# EAGLE schematic Steuerung (EAGLE 9.6.2)
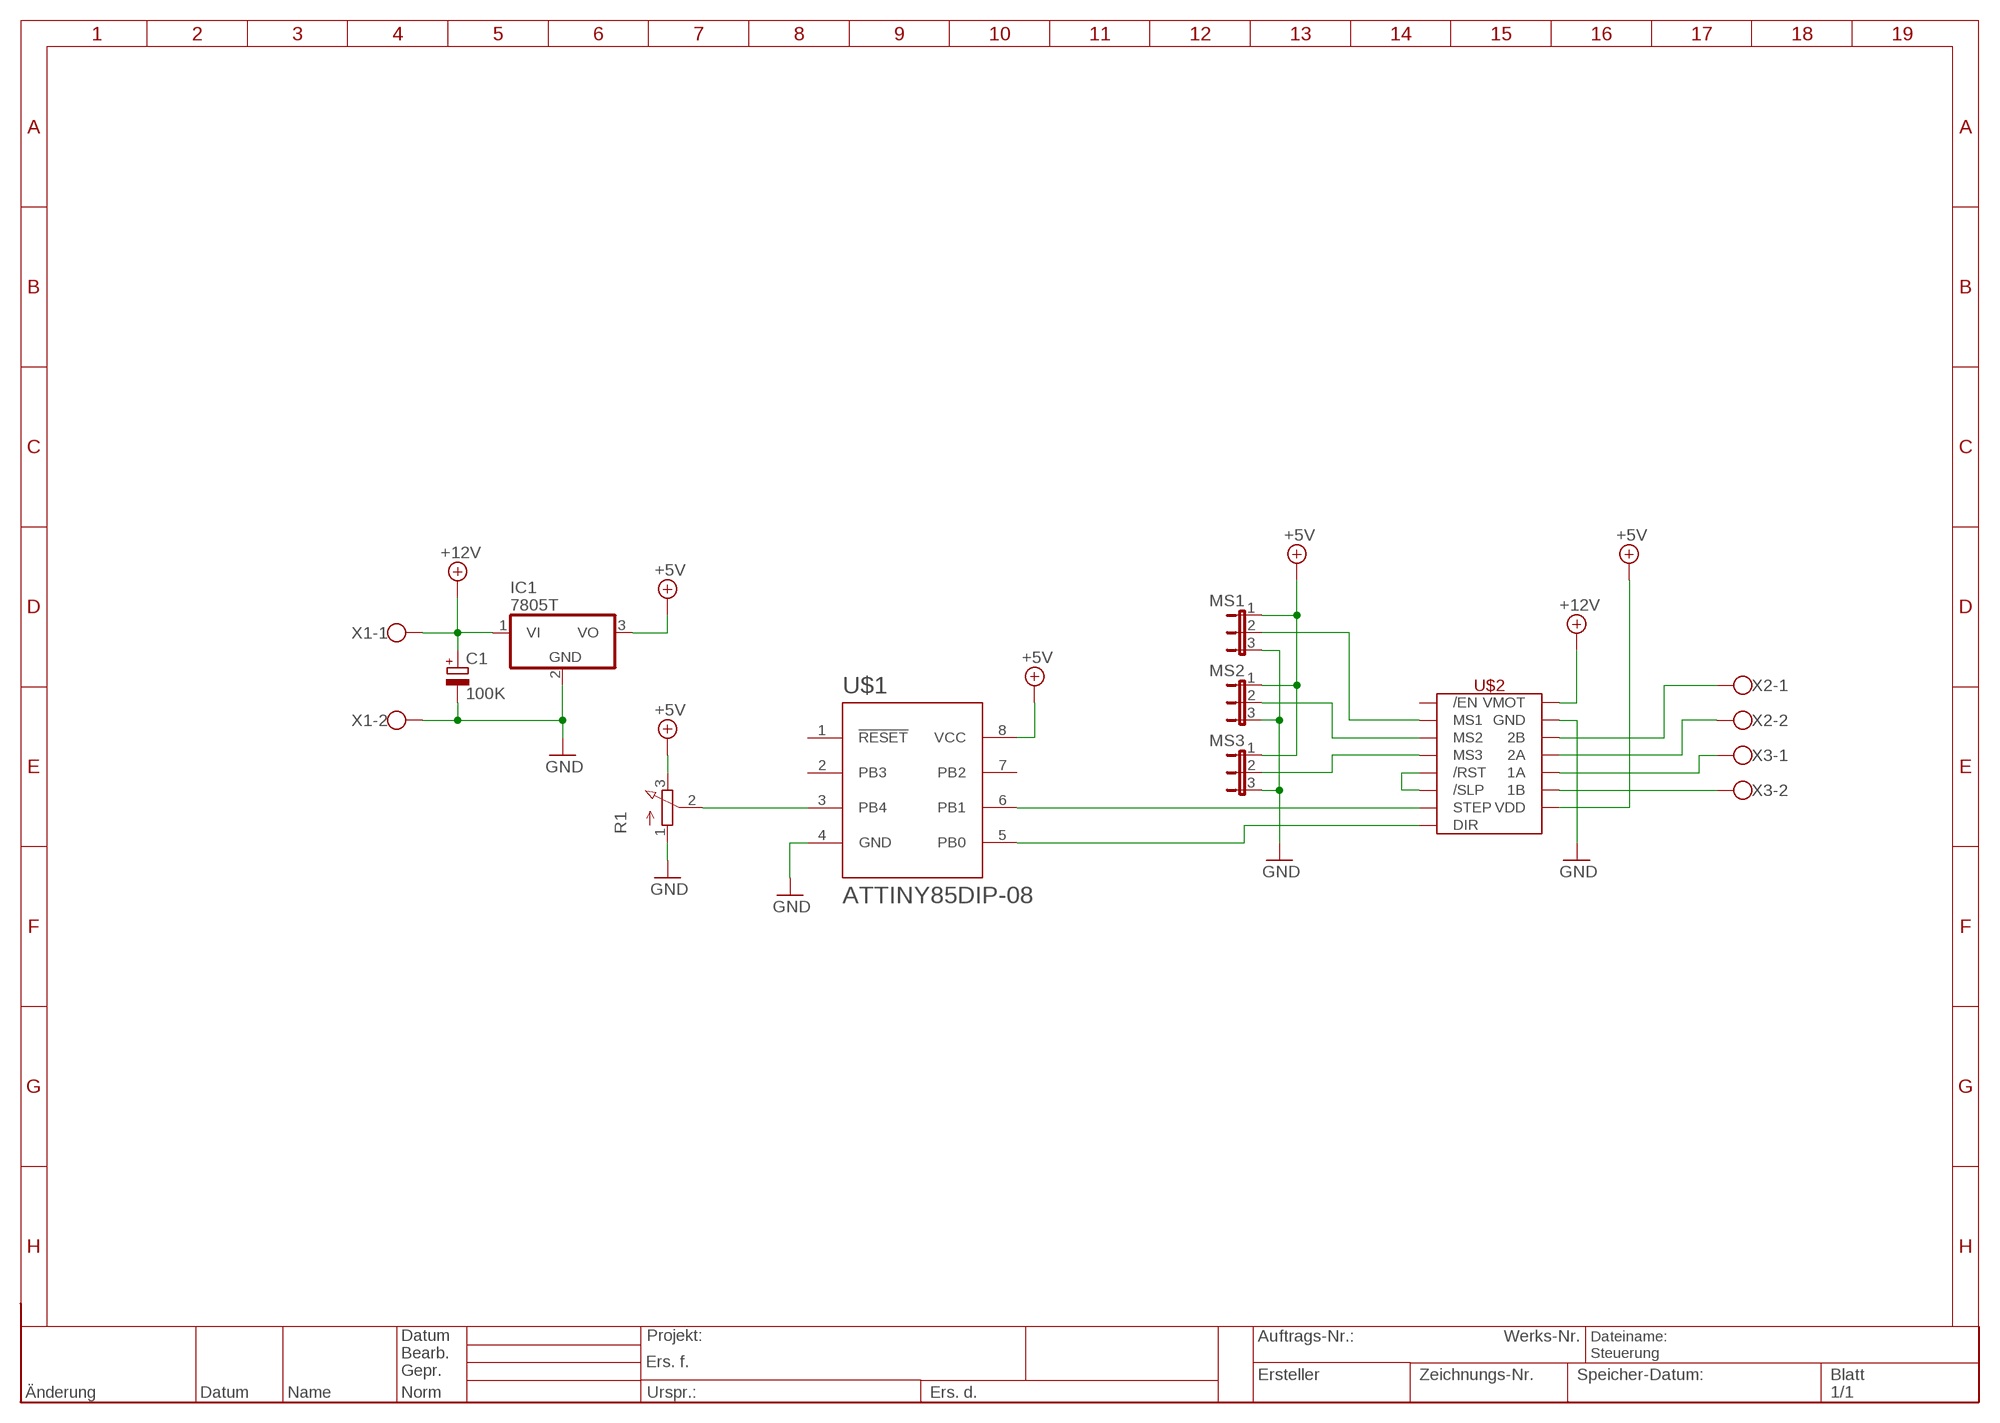
[diagram p0: schematic, sheet 1]

## Parts
C1  100K  CPOL-EUE2-5  [E2-5]
IC1  7805T  [TO220H]
MS1  JP2E  [JP2]
MS2  JP2E  [JP2]
MS3  JP2E  [JP2]
R1  3RP/1610N  [3RP/1610N]
U$1  ATTINY85DIP-08  [DIP900W57P254L920H431Q8B]
U$2  A4988_STEP  [A4988_STEP]
X1  W237-102  [W237-102]
X2  W237-102  [W237-102]
X3  W237-102  [W237-102]

## Nets
+5V: IC1.3(VO) MS1.1 MS2.1 MS3.1 R1.3(E) U$1.8(VCC) U$2.VDD
+12V: C1.+ IC1.1(VI) U$2.VMOT X1.1
GND: C1.- IC1.2(GND) MS1.3 MS2.3 MS3.3 R1.1(A) U$1.4(GND) U$2.GND U$2.GND2(GND) X1.2
N$1: U$2.2B X2.1
N$2: U$2.2A X2.2
N$3: U$2.1A X3.1
N$4: U$2.1B X3.2
N$5: R1.2(S) U$1.3(PB4)
N$6: U$1.5(PB0) U$2.DIR
N$7: U$1.6(PB1) U$2.STEP
N$8: MS3.2 U$2.MS3
N$9: MS2.2 U$2.MS2
N$10: MS1.2 U$2.MS1
N$11: U$2./RST U$2./SLP
Unconnected: U$1.1(!RESET) U$1.2(PB3) U$1.7(PB2) U$2./EN

## Library data of the parts
C1 = resistor:CPOL-EU: POLARIZED CAPACITOR, European symbol
IC1 = adafruit:78*: Positive VOLTAGE REGULATOR Added bigger pads to the TO-92 package
MS1-MS3 = jumper:JP2E: JUMPER
R1 = pot:3RP/1610N: 16mm Potentiometer one level Source: http://www.alphapotentiometers.net/html/16mm_pot_2.html
U$1 = Jakobs_LBR:ATTINY85: Atmel 8-bit AVR Microcontroller with 2/4/8K Bytes In-System Programmable Flash Pinout: 1 - (PCINT5/RESET/ADC0/dW) PB5 2 - (PCINT3/XTAL1/CLKI/OC1B/ADC3) PB3 3 - (PCINT4/XTAL2/CLKO/OC1B/ADC2) PB4 4 - GND 5 - PB0 (MOSI/DI/SDA/AIN0/OC0A/OC1A/AREF/PCINT0) 6 - PB1 (MISO/DO/AIN1/OC0B/OC1A/PCINT1) 7 - PB2 (SCK/USCK/SCL/ADC1/T0/INT0/PCINT2) 8 - VCC
U$2 = IC:A4988_STEP
X1-X3 = con-wago-500:W237-102: WAGO SCREW CLAMP; MPN: 237-102; OC_FARNELL: unknown; OC_NEWARK: 70K9898